# Altium schematic sheet connectors.SchDoc: FPGA-based Sudoku - connectors
size B; Author: Justin Silver; DocumentNumber: 2; Revision: v1.0; SheetNumber: 2; SheetTotal: 4
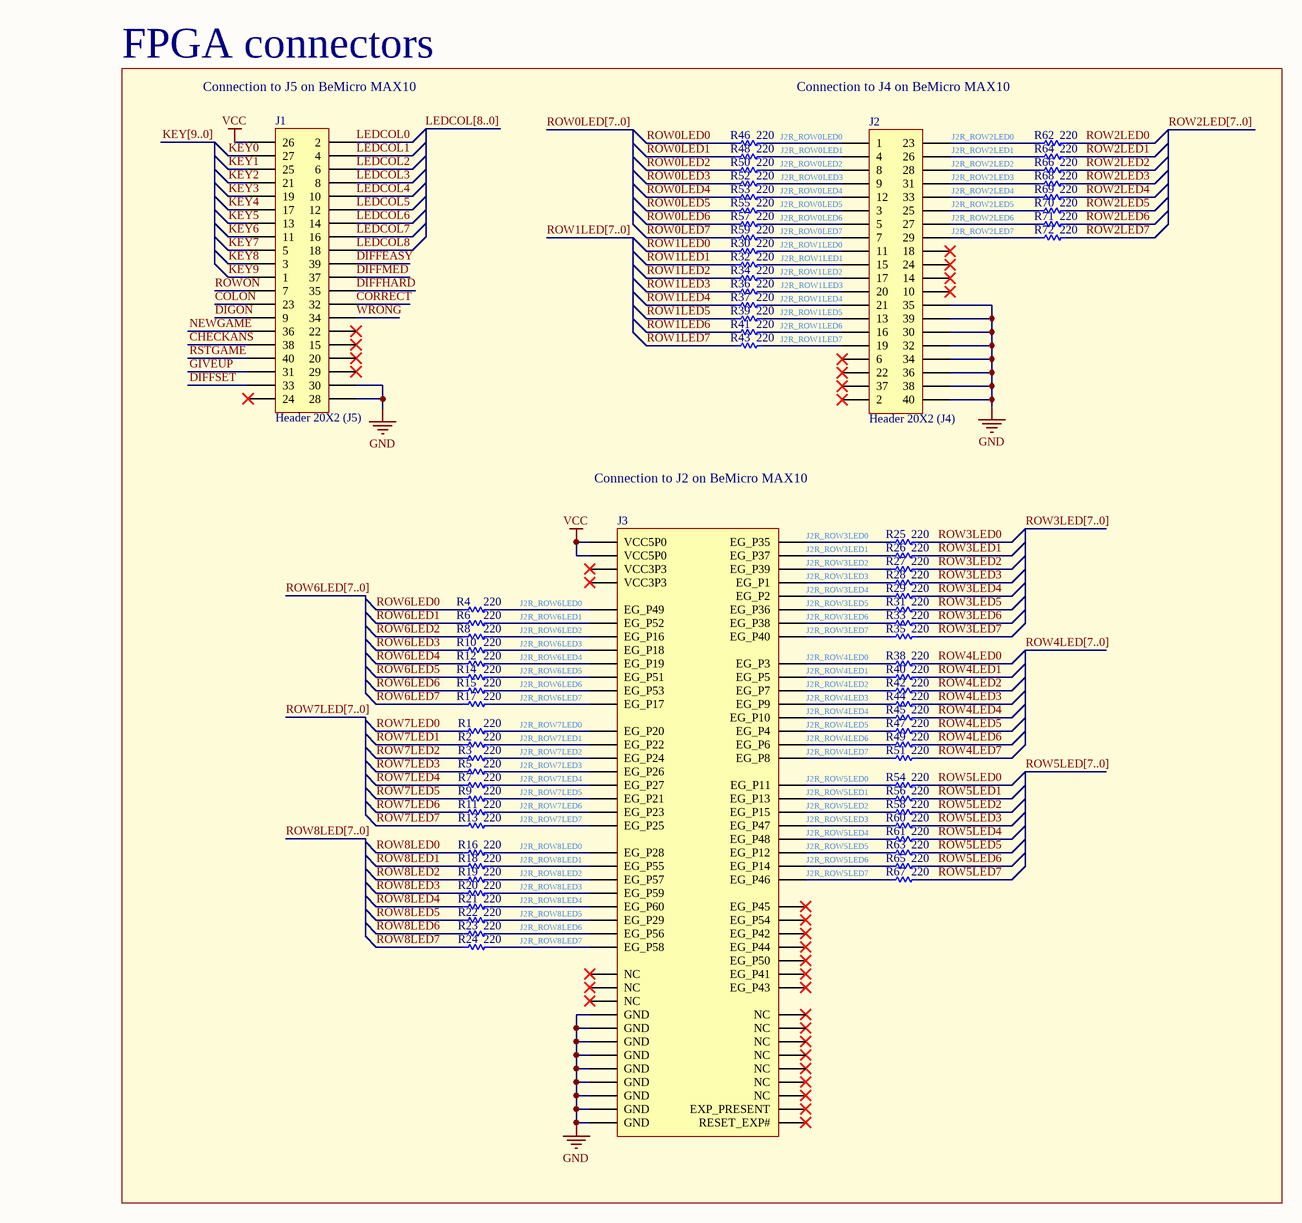
[diagram p0: connectors.SchDoc]

## Parts
J1  Header 20X2 (J5)  [2x20]
J2  Header 20X2 (J4)  [2x20]
J3  (no value)  [SAMTEC_MEC6-140-02-L-D-RA1-TR]
R1  value 220  [SMD-0805-RES]  (hidden comment: Res1)
R2  value 220  [SMD-0805-RES]  (hidden comment: Res1)
R3  value 220  [SMD-0805-RES]  (hidden comment: Res1)
R4  value 220  [SMD-0805-RES]  (hidden comment: Res1)
R5  value 220  [SMD-0805-RES]  (hidden comment: Res1)
R6  value 220  [SMD-0805-RES]  (hidden comment: Res1)
R7  value 220  [SMD-0805-RES]  (hidden comment: Res1)
R8  value 220  [SMD-0805-RES]  (hidden comment: Res1)
R9  value 220  [SMD-0805-RES]  (hidden comment: Res1)
R10  value 220  [SMD-0805-RES]  (hidden comment: Res1)
R11  value 220  [SMD-0805-RES]  (hidden comment: Res1)
R12  value 220  [SMD-0805-RES]  (hidden comment: Res1)
R13  value 220  [SMD-0805-RES]  (hidden comment: Res1)
R14  value 220  [SMD-0805-RES]  (hidden comment: Res1)
R15  value 220  [SMD-0805-RES]  (hidden comment: Res1)
R16  value 220  [SMD-0805-RES]  (hidden comment: Res1)
R17  value 220  [SMD-0805-RES]  (hidden comment: Res1)
R18  value 220  [SMD-0805-RES]  (hidden comment: Res1)
R19  value 220  [SMD-0805-RES]  (hidden comment: Res1)
R20  value 220  [SMD-0805-RES]  (hidden comment: Res1)
R21  value 220  [SMD-0805-RES]  (hidden comment: Res1)
R22  value 220  [SMD-0805-RES]  (hidden comment: Res1)
R23  value 220  [SMD-0805-RES]  (hidden comment: Res1)
R24  value 220  [SMD-0805-RES]  (hidden comment: Res1)
R25  value 220  [SMD-0805-RES]  (hidden comment: Res1)
R26  value 220  [SMD-0805-RES]  (hidden comment: Res1)
R27  value 220  [SMD-0805-RES]  (hidden comment: Res1)
R28  value 220  [SMD-0805-RES]  (hidden comment: Res1)
R29  value 220  [SMD-0805-RES]  (hidden comment: Res1)
R30  value 220  [SMD-0805-RES]  (hidden comment: Res1)
R31  value 220  [SMD-0805-RES]  (hidden comment: Res1)
R32  value 220  [SMD-0805-RES]  (hidden comment: Res1)
R33  value 220  [SMD-0805-RES]  (hidden comment: Res1)
R34  value 220  [SMD-0805-RES]  (hidden comment: Res1)
R35  value 220  [SMD-0805-RES]  (hidden comment: Res1)
R36  value 220  [SMD-0805-RES]  (hidden comment: Res1)
R37  value 220  [SMD-0805-RES]  (hidden comment: Res1)
R38  value 220  [SMD-0805-RES]  (hidden comment: Res1)
R39  value 220  [SMD-0805-RES]  (hidden comment: Res1)
R40  value 220  [SMD-0805-RES]  (hidden comment: Res1)
R41  value 220  [SMD-0805-RES]  (hidden comment: Res1)
R42  value 220  [SMD-0805-RES]  (hidden comment: Res1)
R43  value 220  [SMD-0805-RES]  (hidden comment: Res1)
R44  value 220  [SMD-0805-RES]  (hidden comment: Res1)
R45  value 220  [SMD-0805-RES]  (hidden comment: Res1)
R46  value 220  [SMD-0805-RES]  (hidden comment: Res1)
R47  value 220  [SMD-0805-RES]  (hidden comment: Res1)
R48  value 220  [SMD-0805-RES]  (hidden comment: Res1)
R49  value 220  [SMD-0805-RES]  (hidden comment: Res1)
R50  value 220  [SMD-0805-RES]  (hidden comment: Res1)
R51  value 220  [SMD-0805-RES]  (hidden comment: Res1)
R52  value 220  [SMD-0805-RES]  (hidden comment: Res1)
R53  value 220  [SMD-0805-RES]  (hidden comment: Res1)
R54  value 220  [SMD-0805-RES]  (hidden comment: Res1)
R55  value 220  [SMD-0805-RES]  (hidden comment: Res1)
R56  value 220  [SMD-0805-RES]  (hidden comment: Res1)
R57  value 220  [SMD-0805-RES]  (hidden comment: Res1)
R58  value 220  [SMD-0805-RES]  (hidden comment: Res1)
R59  value 220  [SMD-0805-RES]  (hidden comment: Res1)
R60  value 220  [SMD-0805-RES]  (hidden comment: Res1)
R61  value 220  [SMD-0805-RES]  (hidden comment: Res1)
R62  value 220  [SMD-0805-RES]  (hidden comment: Res1)
R63  value 220  [SMD-0805-RES]  (hidden comment: Res1)
R64  value 220  [SMD-0805-RES]  (hidden comment: Res1)
R65  value 220  [SMD-0805-RES]  (hidden comment: Res1)
R66  value 220  [SMD-0805-RES]  (hidden comment: Res1)
R67  value 220  [SMD-0805-RES]  (hidden comment: Res1)
R68  value 220  [SMD-0805-RES]  (hidden comment: Res1)
R69  value 220  [SMD-0805-RES]  (hidden comment: Res1)
R70  value 220  [SMD-0805-RES]  (hidden comment: Res1)
R71  value 220  [SMD-0805-RES]  (hidden comment: Res1)
R72  value 220  [SMD-0805-RES]  (hidden comment: Res1)

## Nets
GND: J1.28 J1.30 J2.30 J2.32 J2.34 J2.35 J2.36 J2.38 J2.39 J2.40 J3.10(GND) J3.21(GND) J3.22(GND) J3.32(GND) J3.33(GND) J3.44(GND) J3.53(GND) J3.54(GND) J3.76(GND)
VCC: J1.26 J3.79(VCC5P0) J3.80(VCC5P0)
CHECKANS: J1.38
COLON: J1.23
CORRECT: J1.32
DIFFEASY: J1.39
DIFFHARD: J1.35
DIFFMED: J1.37
DIFFSET: J1.33
DIGON: J1.9
GIVEUP: J1.31
J2R_ROW0LED0: J2.1 R46.2
J2R_ROW0LED1: J2.4 R48.2
J2R_ROW0LED2: J2.8 R50.2
J2R_ROW0LED3: J2.9 R52.2
J2R_ROW0LED4: J2.12 R53.2
J2R_ROW0LED5: J2.3 R55.2
J2R_ROW0LED6: J2.5 R57.2
J2R_ROW0LED7: J2.7 R59.2
J2R_ROW1LED0: J2.11 R30.2
J2R_ROW1LED1: J2.15 R32.2
J2R_ROW1LED2: J2.17 R34.2
J2R_ROW1LED3: J2.20 R36.2
J2R_ROW1LED4: J2.21 R37.2
J2R_ROW1LED5: J2.13 R39.2
J2R_ROW1LED6: J2.16 R41.2
J2R_ROW1LED7: J2.19 R43.2
J2R_ROW2LED0: J2.23 R62.1
J2R_ROW2LED1: J2.26 R64.1
J2R_ROW2LED2: J2.28 R66.1
J2R_ROW2LED3: J2.31 R68.1
J2R_ROW2LED4: J2.33 R69.1
J2R_ROW2LED5: J2.25 R70.1
J2R_ROW2LED6: J2.27 R71.1
J2R_ROW2LED7: J2.29 R72.1
J2R_ROW3LED0: J3.06(EG_P35) R25.1
J2R_ROW3LED1: J3.12(EG_P37) R26.1
J2R_ROW3LED2: J3.16(EG_P39) R27.1
J2R_ROW3LED3: J3.05(EG_P1) R28.1
J2R_ROW3LED4: J3.07(EG_P2) R29.1
J2R_ROW3LED5: J3.08(EG_P36) R31.1
J2R_ROW3LED6: J3.14(EG_P38) R33.1
J2R_ROW3LED7: J3.18(EG_P40) R35.1
J2R_ROW4LED0: J3.09(EG_P3) R38.1
J2R_ROW4LED1: J3.13(EG_P5) R40.1
J2R_ROW4LED2: J3.17(EG_P7) R42.1
J2R_ROW4LED3: J3.23(EG_P9) R44.1
J2R_ROW4LED4: J3.25(EG_P10) R45.1
J2R_ROW4LED5: J3.11(EG_P4) R47.1
J2R_ROW4LED6: J3.15(EG_P6) R49.1
J2R_ROW4LED7: J3.19(EG_P8) R51.1
J2R_ROW5LED0: J3.27(EG_P11) R54.1
J2R_ROW5LED1: J3.31(EG_P13) R56.1
J2R_ROW5LED2: J3.37(EG_P15) R58.1
J2R_ROW5LED3: J3.36(EG_P47) R60.1
J2R_ROW5LED4: J3.38(EG_P48) R61.1
J2R_ROW5LED5: J3.29(EG_P12) R63.1
J2R_ROW5LED6: J3.35(EG_P14) R65.1
J2R_ROW5LED7: J3.34(EG_P46) R67.1
J2R_ROW6LED0: J3.40(EG_P49) R4.2
J2R_ROW6LED1: J3.48(EG_P52) R6.2
J2R_ROW6LED2: J3.39(EG_P16) R8.2
J2R_ROW6LED3: J3.43(EG_P18) R10.2
J2R_ROW6LED4: J3.45(EG_P19) R12.2
J2R_ROW6LED5: J3.46(EG_P51) R14.2
J2R_ROW6LED6: J3.50(EG_P53) R15.2
J2R_ROW6LED7: J3.41(EG_P17) R17.2
J2R_ROW7LED0: J3.47(EG_P20) R1.2
J2R_ROW7LED1: J3.51(EG_P22) R2.2
J2R_ROW7LED2: J3.57(EG_P24) R3.2
J2R_ROW7LED3: J3.61(EG_P26) R5.2
J2R_ROW7LED4: J3.63(EG_P27) R7.2
J2R_ROW7LED5: J3.49(EG_P21) R9.2
J2R_ROW7LED6: J3.55(EG_P23) R11.2
J2R_ROW7LED7: J3.59(EG_P25) R13.2
J2R_ROW8LED0: J3.65(EG_P28) R16.2
J2R_ROW8LED1: J3.56(EG_P55) R18.2
J2R_ROW8LED2: J3.60(EG_P57) R19.2
J2R_ROW8LED3: J3.64(EG_P59) R20.2
J2R_ROW8LED4: J3.66(EG_P60) R21.2
J2R_ROW8LED5: J3.67(EG_P29) R22.2
J2R_ROW8LED6: J3.58(EG_P56) R23.2
J2R_ROW8LED7: J3.62(EG_P58) R24.2
KEY0: J1.27
KEY1: J1.25
KEY2: J1.21
KEY3: J1.19
KEY4: J1.17
KEY5: J1.13
KEY6: J1.11
KEY7: J1.5
KEY8: J1.3
KEY9: J1.1
LEDCOL0: J1.2
LEDCOL1: J1.4
LEDCOL2: J1.6
LEDCOL3: J1.8
LEDCOL4: J1.10
LEDCOL5: J1.12
LEDCOL6: J1.14
LEDCOL7: J1.16
LEDCOL8: J1.18
NEWGAME: J1.36
ROW0LED0: R46.1
ROW0LED1: R48.1
ROW0LED2: R50.1
ROW0LED3: R52.1
ROW0LED4: R53.1
ROW0LED5: R55.1
ROW0LED6: R57.1
ROW0LED7: R59.1
ROW1LED0: R30.1
ROW1LED1: R32.1
ROW1LED2: R34.1
ROW1LED3: R36.1
ROW1LED4: R37.1
ROW1LED5: R39.1
ROW1LED6: R41.1
ROW1LED7: R43.1
ROW2LED0: R62.2
ROW2LED1: R64.2
ROW2LED2: R66.2
ROW2LED3: R68.2
ROW2LED4: R69.2
ROW2LED5: R70.2
ROW2LED6: R71.2
ROW2LED7: R72.2
ROW3LED0: R25.2
ROW3LED1: R26.2
ROW3LED2: R27.2
ROW3LED3: R28.2
ROW3LED4: R29.2
ROW3LED5: R31.2
ROW3LED6: R33.2
ROW3LED7: R35.2
ROW4LED0: R38.2
ROW4LED1: R40.2
ROW4LED2: R42.2
ROW4LED3: R44.2
ROW4LED4: R45.2
ROW4LED5: R47.2
ROW4LED6: R49.2
ROW4LED7: R51.2
ROW5LED0: R54.2
ROW5LED1: R56.2
ROW5LED2: R58.2
ROW5LED3: R60.2
ROW5LED4: R61.2
ROW5LED5: R63.2
ROW5LED6: R65.2
ROW5LED7: R67.2
ROW6LED0: R4.1
ROW6LED1: R6.1
ROW6LED2: R8.1
ROW6LED3: R10.1
ROW6LED4: R12.1
ROW6LED5: R14.1
ROW6LED6: R15.1
ROW6LED7: R17.1
ROW7LED0: R1.1
ROW7LED1: R2.1
ROW7LED2: R3.1
ROW7LED3: R5.1
ROW7LED4: R7.1
ROW7LED5: R9.1
ROW7LED6: R11.1
ROW7LED7: R13.1
ROW8LED0: R16.1
ROW8LED1: R18.1
ROW8LED2: R19.1
ROW8LED3: R20.1
ROW8LED4: R21.1
ROW8LED5: R22.1
ROW8LED6: R23.1
ROW8LED7: R24.1
ROWON: J1.7
RSTGAME: J1.40
WRONG: J1.34

Not connected (* = marked no-connect by the designer): J1 15* 20* 22* 24* 29*; J2 2* 6* 10* 14* 18* 22* 24* 37*; J3 01(VCC3P3)* 02(VCC3P3)* 03(RESET_EXP#)* 04(NC)* 20(EG_P41)* 24(EG_P42)* 26(EG_P43)* 28(EG_P44)* 30(EG_P45)* 42(EG_P50)* 52(EG_P54)* 68(NC)* 69(NC)* 70(NC)* 71(NC)* 72(NC)* 73(NC)* 74(NC)* 75(NC)* 77(NC)* 78(EXP_PRESENT)*

## Buses and harness runs
bus KEY[9..0]
bus LEDCOL[8..0]
bus ROW0LED[7..0]
bus ROW1LED[7..0]
bus ROW2LED[7..0]
bus ROW3LED[7..0]
bus ROW4LED[7..0]
bus ROW5LED[7..0]
bus ROW6LED[7..0]
bus ROW7LED[7..0]
bus ROW8LED[7..0]

## Notes on the sheet
- FPGA connectors
- (near J1) Connection to J5 on BeMicro MAX10
- Connection to J4 on BeMicro MAX10
- (near J1) With the J4 FPGA header, we can only connect 24 signals. We are free to pin swap on the PCB header, and then in Quartus pin planner we can choose where to connect the signals.
  With the J5 connector, we can only connect 36 signals. We are free to pin swap on the PCB side.
  We are allowed to completely pin swap the jumpers on the PCB side, since we are manually connecting the jumpers from the FPGA to PCB
- Connection to J2 on BeMicro MAX10
- Pin information
  ***VCC and GND pin not included in count
  Dev kit pins needed: 102 (3 for difficulty, 72 for segments, 9 for columns, 10 for keyboard matrix, 3 for ON signals, 5 for game options
  EDGE CONNECTOR (MEC6-140_CARD =
  MEC6-140-02-L-D-RA1-TR ): 60 GPIO (EG_PX)
  PIN_HEADER_2x20 (J5): 36
  PIN_HEADER_2x20 (J4): 26
  Idea: Header J5 takes care of all the signals that are not for the LED segment lines
  Edge connector and J4 take care of all the LED segment lines
  So I would have a 30 pin header (for J5 non LED seg pins), then the max connector for 60 pins (LED seg edge) then a 12 pin header (rest of LED seg pins)

## Library data of the parts
J1 J2 = Header 20X2: Header, 20-Pin, Dual row; LatestRevisionDate: 17-Jul-2002; LatestRevisionNote: Re-released for DXP Platform.; Publisher: Altium Limited
J3 = MEC6-140-02-L-D-RA1-TR: Edge connector; MF: Samtec; Price: None; Availability: Unavailable; Package: None; Value: *; MP: MEC6-140-02-L-D-RA1-TR
R1-R72 = Res1: Resistor; Published: 8-Jun-2000; LatestRevisionDate: 17-Jul-2002; LatestRevisionNote: Re-released for DXP Platform.; PackageReference: AXIAL-0.3; Publisher: Altium Limited; PackageDescription: Axial Device, Thru-Hole; 2 Leads; 0.3 in Pin Spacing